# Altium schematic sheet MOSFET Driver.SchDoc
size B; Organization: Altium Limited; Address1: L3, 12a Rodborough Rd; Address2: Frenchs Forest; Address3: NSW; Address4: Australia 2086; SheetNumber: 1; SheetTotal: 1
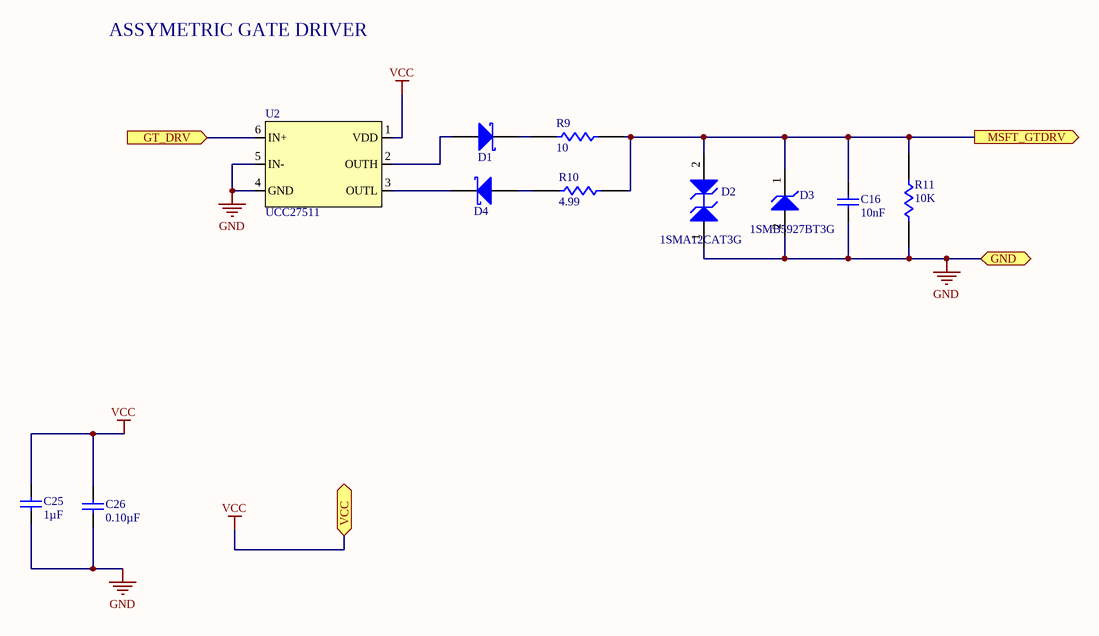
[diagram p0: MOSFET Driver.SchDoc]

## Parts
C16  10nF  [CAP0603]
C25  Capacitance: 1µF  [CAP1210]  (hidden comment: GRM32RR71H105KA01K)
C26  Capacitance: 0.10µF  [CAP0603]  (hidden comment: 06035C104KAT2A)
D1  DB2W40300L  [Mini2-F3-B]  (value not drawn)
D2  1SMA12CAT3G  [ONSC-SMA-2-403D-02_F_V]
D3  1SMB5927BT3G  [ONSC-SMB-2-403A-03_H_V]
D4  DB2W40300L  [Mini2-F3-B]  (value not drawn)
R9  Resistance: 10  [RES0805]  (hidden comment: CRCW0805R10)
R10  Resistance: 4.99  [RES0805]  (hidden comment: CRCW0805R4.99)
R11  Resistance: 10K  [RES0603]  (hidden comment: CRCW0603RES10K)
U2  IC name: UCC27511  [SOP6]  (hidden comment: UCC27511DBV)

## Ports
GND, GT_DRV (in), MSFT_GTDRV (out), VCC

## Nets
GND: C16.1 C25.1 C26.1 D2.1(A1) D3.2(A) R11.2 U2.4(GND) U2.5(IN-) ; port GND
VCC: C25.2 C26.2 U2.1(VDD) ; port VCC
GT_DRV: U2.6(IN+) ; port GT_DRV
MSFT_GTDRV: C16.2 D2.2(A2) D3.1(K) R9.1 R10.1 R11.1 ; port MSFT_GTDRV
NetD1_1: D1.1(K) R9.2
NetD1_3: D1.3(A) U2.2(OUTH)
NetD4_1: D4.1(K) U2.3(OUTL)
NetD4_3: D4.3(A) R10.2

## Notes on the sheet
- ASSYMETRIC GATE DRIVER
- Title:
- Size:
- B
- Document Number:
- Revision:
- Designer:
- Approval Date:
- Start Date:
- MM/DD/YY
- --/--/--
- Sheet:
- of
- Approver:
- CONFIDENTIAL
- Project Name/Number:

## Library data of the parts
C16 = C0603C103F3GACTU: CAP CER 10000PF 25V C0G/NP0 0603; Manufacturer: KEMET; Tolerance: ±1%; Temperature Coefficient: C0G, NP0; Supplier 1: Digi-Key; Manufacturer Part Number: C0603C103F3GACTU; RoHS: RoHS Compliant; Category: Capacitors; Stock 1: 70811; Pricing 1: 1=1.26, 10=0.992, 100=0.7437, 500=0.56194, 1000=0.49583 (USD); Packaging: Cut Tape (CT); Part Status: Active; Voltage - Rated: 25V; Operating Temperature: -55°C ~ 125°C; Features: Low ESL; Ratings: -; Applications: General Purpose; Failure Rate: -; Mounting Type: Surface Mount, MLCC; Package / Case: 0603 (1608 Metric); Size / Dimension: 0.063" L x 0.031" W (1.60mm x 0.80mm); Height - Seated (Max): -; Thickness (Max): 0.034" (0.87mm); Lead Spacing: -; Lead Style: -; ComponentLink1URL: http://www.kemet.com/docfinder?Partnumber=C0603C103F3GACTU; ComponentLink1Description: http://www.kemet.com/docfinder?Partnumber=C0603C103F3GACTU; Supplier Part Number 1: 399-8985-1-ND
C25 = GRM32RR71H105KA01K: CAP CER 1UF 50V X7R 1210; Manufacturer 1: Murata Electronics North America; Category 1: Capacitors; Tolerance: ±10%; Description 2: CAP CER 0.1UF 50V X7R 1206; Supplier 1: Digi-Key; Supplier Part Number 1: 490-11661-1-ND; Manufacturer Part Number 1: GRM32RR71H105KA01K; RoHS 1: RoHS Compliant; Description 1: CAP CER 1UF 50V X7R 1210; Stock 1: 3574; Pricing 1: 1=0.32, 10=0.28, 50=0.17, 100=0.14, 250=0.112, 500=0.102, 1000=0.092 (USD); Packaging: Cut Tape (CT); Part Status: Active; Voltage - Rated: 50V; Temperature Coefficient: X7R; Operating Temperature: -55°C ~ 125°C; Features: -; Ratings: -; Applications: General Purpose; Mounting Type: Surface Mount, MLCC; Package / Case: 1210 (3225 Metric); Size / Dimension: 0.126" L x 0.098" W (3.20mm x 2.50mm); Height - Seated (Max): -; Thickness (Max): 0.079" (2.00mm); Lead Spacing: -; Lead Style: -; ComponentLink1URL: http://www.murata.com/~/media/webrenewal/support/library/catalog/products/capacitor/mlcc/c02e.pdf; ComponentLink1Description: http://www.murata.com/~/media/webrenewal/support/library/catalog/products/capacitor/mlcc/c02e.pdf; Supplier 2: Digi-Key; Supplier Part Number 2: 478-1556-1-ND; Manufacturer 2: AVX Corporation; Manufacturer Part Number 2: 12065C104KAT2A; RoHS 2: RoHS Compliant; Category 2: Capacitors; Stock 2: 1310883; Pricing 2: 1=0.1, 10=0.073, 25=0.0528, 50=0.0412, 100=0.0341, 250=0.02824, 500=0.02392, 1000=0.0198 (USD); ComponentLink2URL: http://datasheets.avx.com/X7RDielectric.pdf; ComponentLink2Description: http://datasheets.avx.com/X7RDielectric.pdf
C26 = 06035C104KAT2A: CAP CER 0.1UF 50V X7R 0603; Manufacturer 1: AVX Corporation; Category 1: Capacitors; Tolerance: ±10%; Supplier 1: Digi-Key; Supplier Part Number 1: 478-5052-6-ND; Manufacturer Part Number 1: 06035C104KAT2A; RoHS 1: RoHS Compliant; Description 1: CAP CER 0.1UF 50V X7R 0603; Stock 1: 1164910; Pricing 1: 1=0.1, 10=0.037, 25=0.0268, 50=0.0202, 100=0.0165, 250=0.01376, 500=0.01176, 1000=0.00924 (USD); Packaging: Digi-Reel®; Part Status: Active; Voltage - Rated: 50V; Temperature Coefficient: X7R; Operating Temperature: -55°C ~ 125°C; Features: -; Ratings: -; Applications: General Purpose; Mounting Type: Surface Mount, MLCC; Package / Case: 0603 (1608 Metric); Size / Dimension: 0.063" L x 0.032" W (1.60mm x 0.81mm); Height - Seated (Max): -; Thickness (Max): 0.035" (0.90mm); Lead Spacing: -; Lead Style: -; ComponentLink1URL: http://datasheets.avx.com/X7RDielectric.pdf; ComponentLink1Description: http://datasheets.avx.com/X7RDielectric.pdf
D1 D4 = DB2W40300L: Manufacturer: Panasonic; Diode: DB24403
D2 = 1SMA12CAT3G: 400 W Peak Power Zener Transient Voltage Suppressor, 2-Pin SMA, Pb-Free, Tape and Reel; Manufacturer: On Semiconductor; Direction: Bidirectional; IR Max (uA): 2.5; PPK Max (W): 400; V(BR) Typ (V): 14; DatasheetVersion: Rev. 12; PackageVersion: Rev. F, 11/2008; PackageReference: SMA-2-403D-02_F; PackageDescription: 2-Pin Small Molded Package, J-Bend Lead, Body 2.605 x 4.315 mm; Supplier 1: Digi-Key; Supplier Part Number 1: 1SMA12CAT3GOSTR-ND; Supplier 2: Digi-Key; Supplier Part Number 2: 1SMA12CAT3GOSCT-ND; Supplier 3: Digi-Key; Supplier Part Number 3: 1SMA12CAT3GOSDKR-ND; Supplier 4: Farnell; Supplier Part Number 4: 2369441; Supplier 5: Newark; Supplier Part Number 5: 10N9650; Supplier 6: Mouser; Supplier Part Number 6: 863-1SMA12CAT3G; Packing: Tape and Reel; RoHS: Pb-Free; Mounting Technology: Surface Mount; PartNumber: 1SMA12CAT3G; ComponentLink1Description: Manufacturer URL; ComponentLink1URL: http://www.onsemi.com/; ComponentLink2Description: Datasheet; ComponentLink2URL: http://www.onsemi.com/pub_link/Collateral/1SMA10CAT3-D.PDF; ComponentLink3Description: Package Specification; ComponentLink3URL: http://www.onsemi.com/pub_link/Collateral/1SMA5913BT3-D.PDF
D3 = 1SMB5927BT3G: 3 W Zener Voltage Regulator, 2-Pin SMB, Pb-Free, Tape and Reel; Manufacturer: On Semiconductor; VZ Typ (V): 12; DatasheetVersion: Rev. 8; PackageVersion: Rev. H, 05/2011; PackageReference: SMB-2-403A-03_H; PackageDescription: 2-Pin Small Molded Package, J-Bend Lead, Body 4.33 x 3.625 mm; Supplier 1: Digi-Key; Supplier Part Number 1: 1SMB5927BT3GOSTR-ND; Supplier 2: Digi-Key; Supplier Part Number 2: 1SMB5927BT3GOSCT-ND; Supplier 3: Farnell; Supplier Part Number 3: 1431169RL; Supplier 4: Farnell; Supplier Part Number 4: 1431169; Supplier 5: Farnell; Supplier Part Number 5: 2368211; Supplier 6: Newark; Supplier Part Number 6: 45J2452; Supplier 7: Newark; Supplier Part Number 7: 67R1409; Supplier 8: Mouser; Supplier Part Number 8: 863-1SMB5927BT3G; Packing: Tape and Reel; RoHS: Pb-Free; Mounting Technology: Surface Mount; PartNumber: 1SMB5927BT3G; ComponentLink1Description: Manufacturer URL; ComponentLink1URL: http://www.onsemi.com/; ComponentLink2Description: Datasheet; ComponentLink2URL: http://www.onsemi.com/pub_link/Collateral/1SMB5913BT3-D.PDF; ComponentLink3Description: Package Specification; ComponentLink3URL: http://www.onsemi.com/pub_link/Collateral/1SMB5913BT3-D.PDF